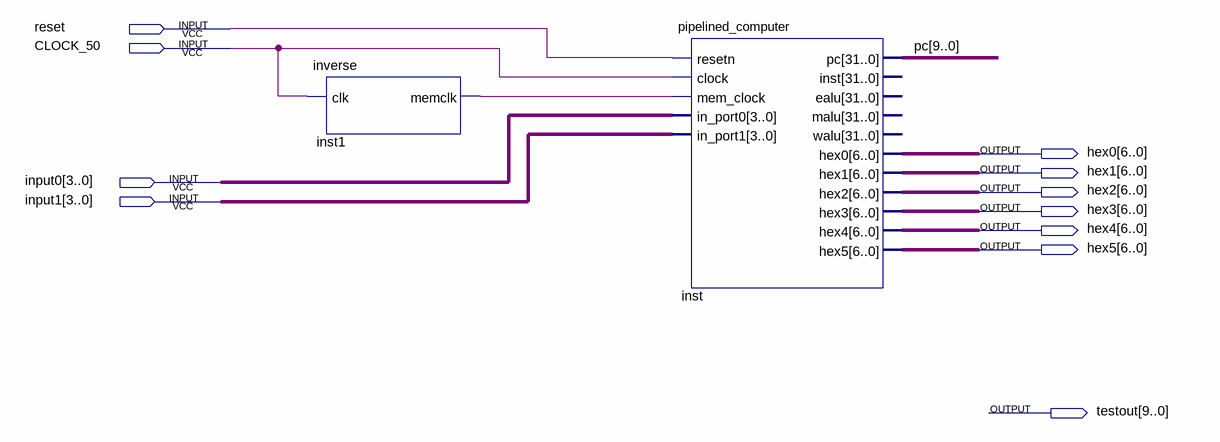
[diagram p0: schematic sheet]
// Quartus schematic pipelined_computer_test.bdf as structural Verilog: 2 symbols, 11 pins
module pipelined_computer_test (
  input  reset,
  input  CLOCK_50,
  input  [3:0] input0,
  input  [3:0] input1,
  output [6:0] hex0,
  output [6:0] hex1,
  output [6:0] hex2,
  output [6:0] hex3,
  output [6:0] hex4,
  output [6:0] hex5,
  output [9:0] testout
);

  wire inst1_memclk;
  wire [9:0] pc;

  inverse inst1 (.clk(CLOCK_50), .memclk(inst1_memclk));
  pipelined_computer inst (
    .resetn(reset), .clock(CLOCK_50), .mem_clock(inst1_memclk), .in_port0(input0), .in_port1(input1),
    .pc(pc), .hex0(hex0), .hex1(hex1), .hex2(hex2), .hex3(hex3), .hex4(hex4), .hex5(hex5));  // open: inst, ealu, malu, walu
endmodule
